# EAGLE design sch-FIX (EAGLE 6.3)
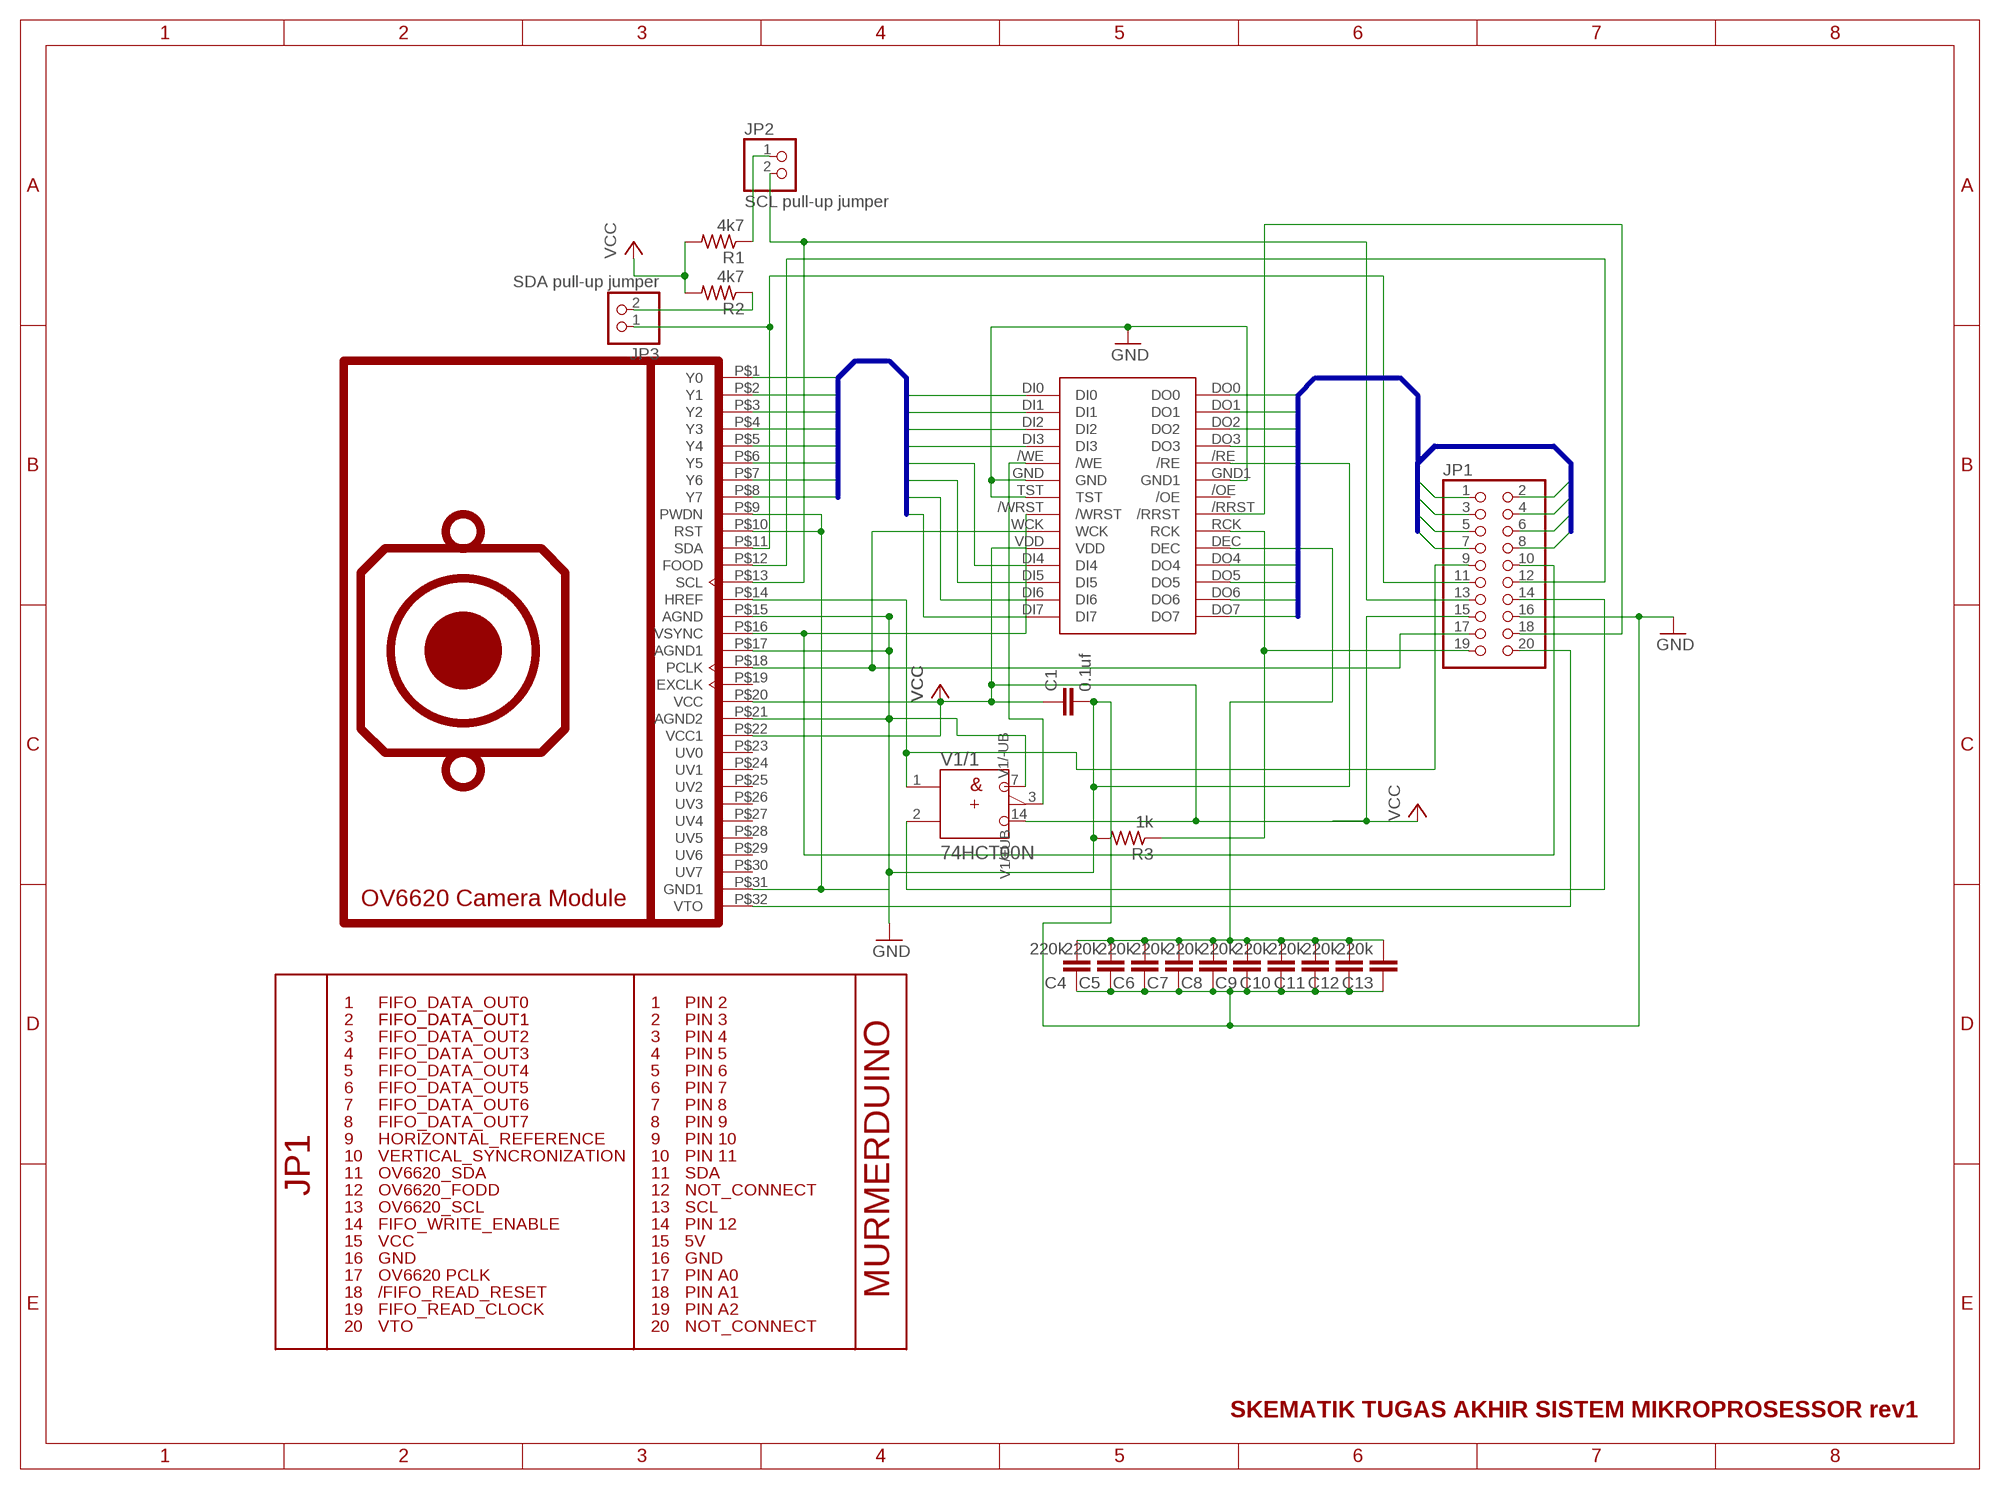
[diagram p0: schematic, sheet 1]

## Parts
C1  0.1uf  C-EU025-025X050  [C025-025X050]
C4  220k  C-EU050-025X075  [C050-025X075]
C5  220k  C-EU050-025X075  [C050-025X075]
C6  220k  C-EU050-025X075  [C050-025X075]
C7  220k  C-EU050-025X075  [C050-025X075]
C8  220k  C-EU050-025X075  [C050-025X075]
C9  220k  C-EU050-025X075  [C050-025X075]
C10  220k  C-EU050-025X075  [C050-025X075]
C11  220k  C-EU050-025X075  [C050-025X075]
C12  220k  C-EU050-025X075  [C050-025X075]
C13  220k  C-EU050-025X075  [C050-025X075]
JP1  PINHD-2X10  [2X10]
JP2  SCL pull-up jumper  PINHD-1X2  [1X02]
JP3  SDA pull-up jumper  PINHD-1X2  [1X02]
R1  4k7  R-US_0204/7  [0204/7]
R2  4k7  R-US_0204/7  [0204/7]
R3  1k  R-US_0204/7  [0204/7]
U$1  AL422REMOVABLE_MOUNT  [AL422REMOVABLE_MOUNT]
U$2  C3088MODULE  [C3088MODULE]
V1  74HCT00N  [DIL14]

## Nets
/FIFO_READ_RESET: JP1.18 U$1./RRST
DATA0: U$1.DI0 U$2.P$1(Y0)
DATA1: U$1.DI1 U$2.P$2(Y1)
DATA2: U$1.DI2 U$2.P$3(Y2)
DATA3: U$1.DI3 U$2.P$4(Y3)
DATA4: U$1.DI4 U$2.P$5(Y4)
DATA5: U$1.DI5 U$2.P$6(Y5)
DATA6: U$1.DI6 U$2.P$7(Y6)
DATA7: U$1.DI7 U$2.P$8(Y7)
FIFO_DATA_OUT0: JP1.1 U$1.DO0
FIFO_DATA_OUT1: JP1.2 U$1.DO1
FIFO_DATA_OUT2: JP1.3 U$1.DO2
FIFO_DATA_OUT3: JP1.4 U$1.DO3
FIFO_DATA_OUT4: JP1.5 U$1.DO4
FIFO_DATA_OUT5: JP1.6 U$1.DO5
FIFO_DATA_OUT6: JP1.7 U$1.DO6
FIFO_DATA_OUT7: JP1.8 U$1.DO7
FIFO_READ_CLOCK: JP1.19 R3.1 U$1.RCK
FIFO_WRITE_ENABLE: JP1.14 V1.2(/1:B)
GND: C1.2 C4.1 C5.1 C6.1 C7.1 C8.1 C9.1 C10.1 C11.1 C12.1 C13.1 JP1.16 R3.2 U$1./RE U$2.P$9(PWDN) U$2.P$10(RST) U$2.P$15(AGND) U$2.P$17(AGND1) U$2.P$21(AGND2) U$2.P$31(GND1) V1.7(/-UB:-UB)
HORIZONTAL_REFERENCE: JP1.9 U$2.P$14(HREF) V1.1(/1:A)
N$1: JP1.20 U$2.P$32(VTO)
N$2: U$1./WE V1.3(/1:Y)
N$3: JP1.17 U$1.WCK U$2.P$18(PCLK)
N$4: JP2.1 R1.1
N$6: JP3.2 R2.1
N$10: C4.2 C5.2 C6.2 C7.2 C8.2 C9.2 C10.2 C11.2 C12.2 C13.2 U$1.DEC
N$13: R1.2 R2.2 ; supply symbol labelled VCC
N$14: U$1.GND U$1.GND1 U$1.TST ; supply symbol labelled GND
OV6620_FODD: JP1.12 U$2.P$12(FOOD)
OV6620_SCL: JP1.13 JP2.2 U$2.P$13(SCL)
OV6620_SDA: JP1.11 JP3.1 U$2.P$11(SDA)
VCC: C1.1 JP1.15 U$1.VDD U$2.P$20(VCC) U$2.P$22(VCC1) V1.14(/+UB:+UB)
VERTICAL_SYNCRONIZATION: JP1.10 U$1./WRST U$2.P$16(VSYNC)
Unconnected: U$1./OE U$2.P$19(EXCLK) U$2.P$23(UV0) U$2.P$24(UV1) U$2.P$25(UV2) U$2.P$26(UV3) U$2.P$27(UV4) U$2.P$28(UV5) U$2.P$29(UV6) U$2.P$30(UV7) V1.4(/2:A) V1.5(/2:B) V1.6(/2:Y) V1.8(/3:Y) V1.9(/3:A) V1.10(/3:B) V1.11(/4:Y) V1.12(/4:A) V1.13(/4:B)

## Buses
FIFO_DATA_OUT[0..7]
DATA[0..7]

## Notes on the sheet
- 1 | 1 | PIN 2
- 2 | 2 | PIN 3
- 3 | 3 | PIN 4
- 4 | 4 | PIN 5
- 5 | 5 | PIN 6
- 6 | 6 | PIN 7
- 7 | 7 | PIN 8
- 8 | 8 | PIN 9
- 9 | 9 | PIN 10
- 10 | 10 | PIN 11
- 11 | 11 | SDA
- JP1 | 12 | 12 | NOT_CONNECT
- 13 | 13 | SCL
- 14 | 14 | PIN 12
- 15 | 15 | 5V
- 16 | 16 | GND
- 17 | OV6620 PCLK | 17 | PIN A0
- 18 | 18 | PIN A1 | MURMERDUINO
- 19 | 19 | PIN A2
- 20 | VTO | 20 | NOT_CONNECT
- SKEMATIK TUGAS AKHIR SISTEM MIKROPROSESSOR rev1

## Library data of the parts
C1 C4-C13 = rcl:C-EU: CAPACITOR, European symbol
JP1 = pinhead:PINHD-2X10: PIN HEADER
JP2 JP3 = pinhead:PINHD-1X2: PIN HEADER
R1-R3 = rcl:R-US_: RESISTOR, American symbol
U$1 = Tugas-Akhir-Sistem-Mikroprossesor:AL422REMOVABLE_MOUNT
U$2 = Tugas-Akhir-Sistem-Mikroprossesor:C3088MODULE
V1 = 74ttl-din:74*00: Quad 2-input NAND gate

## Board
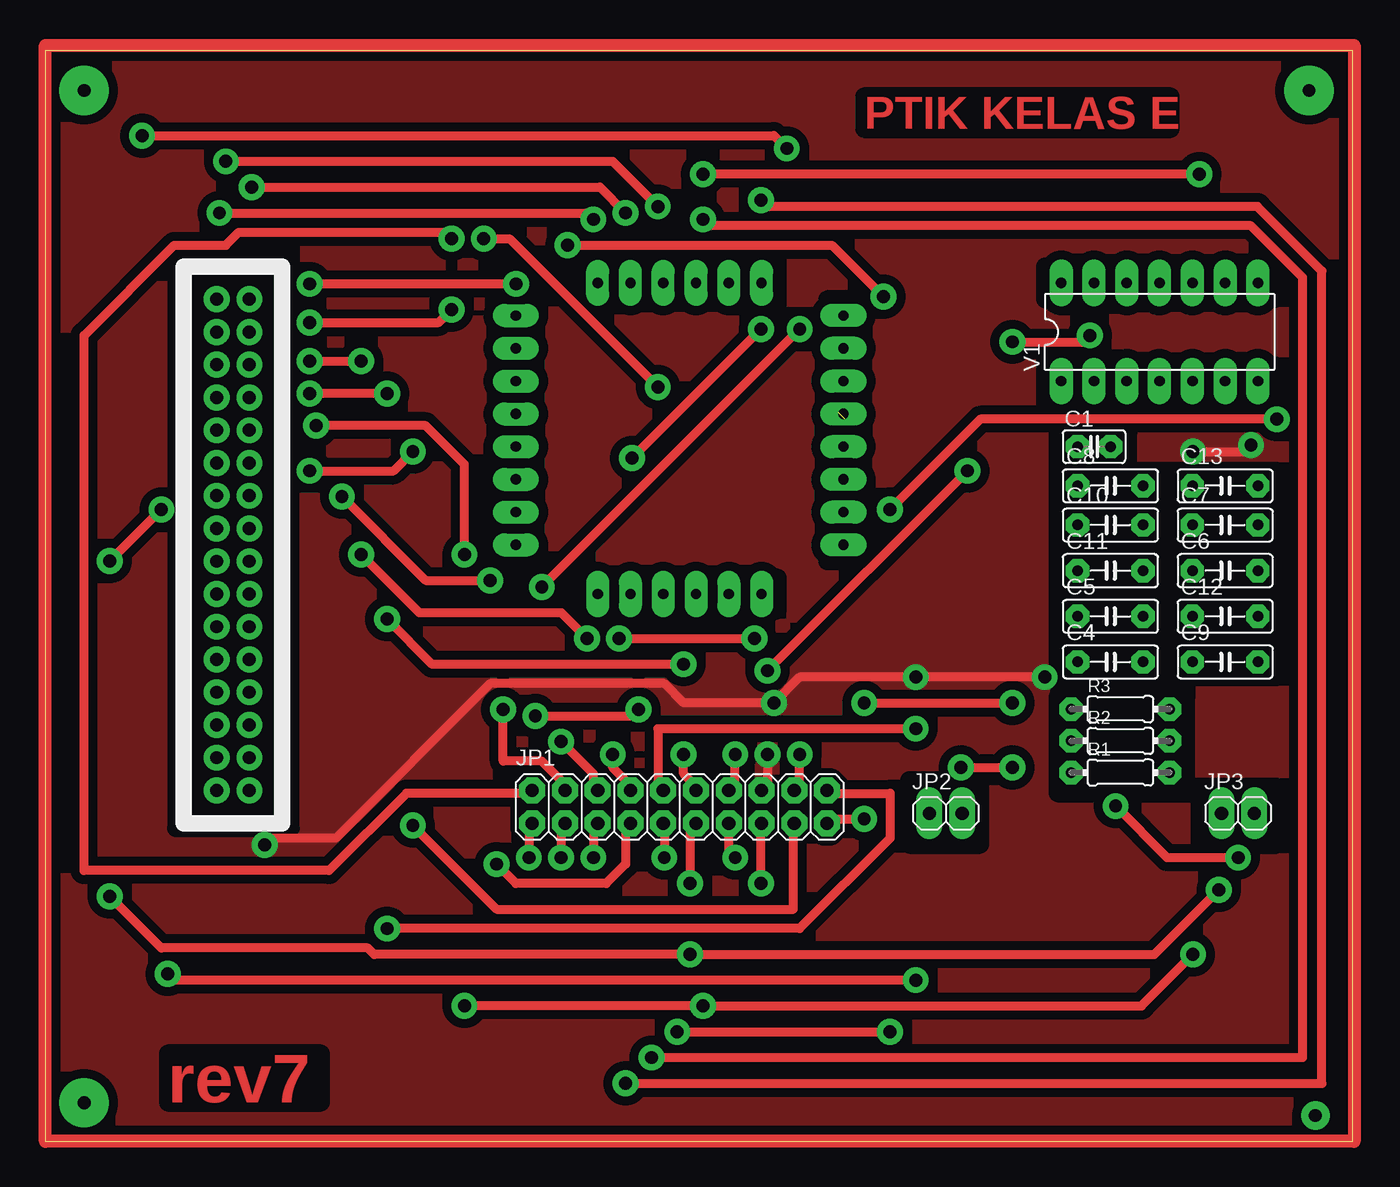
[diagram p1: board, top side]
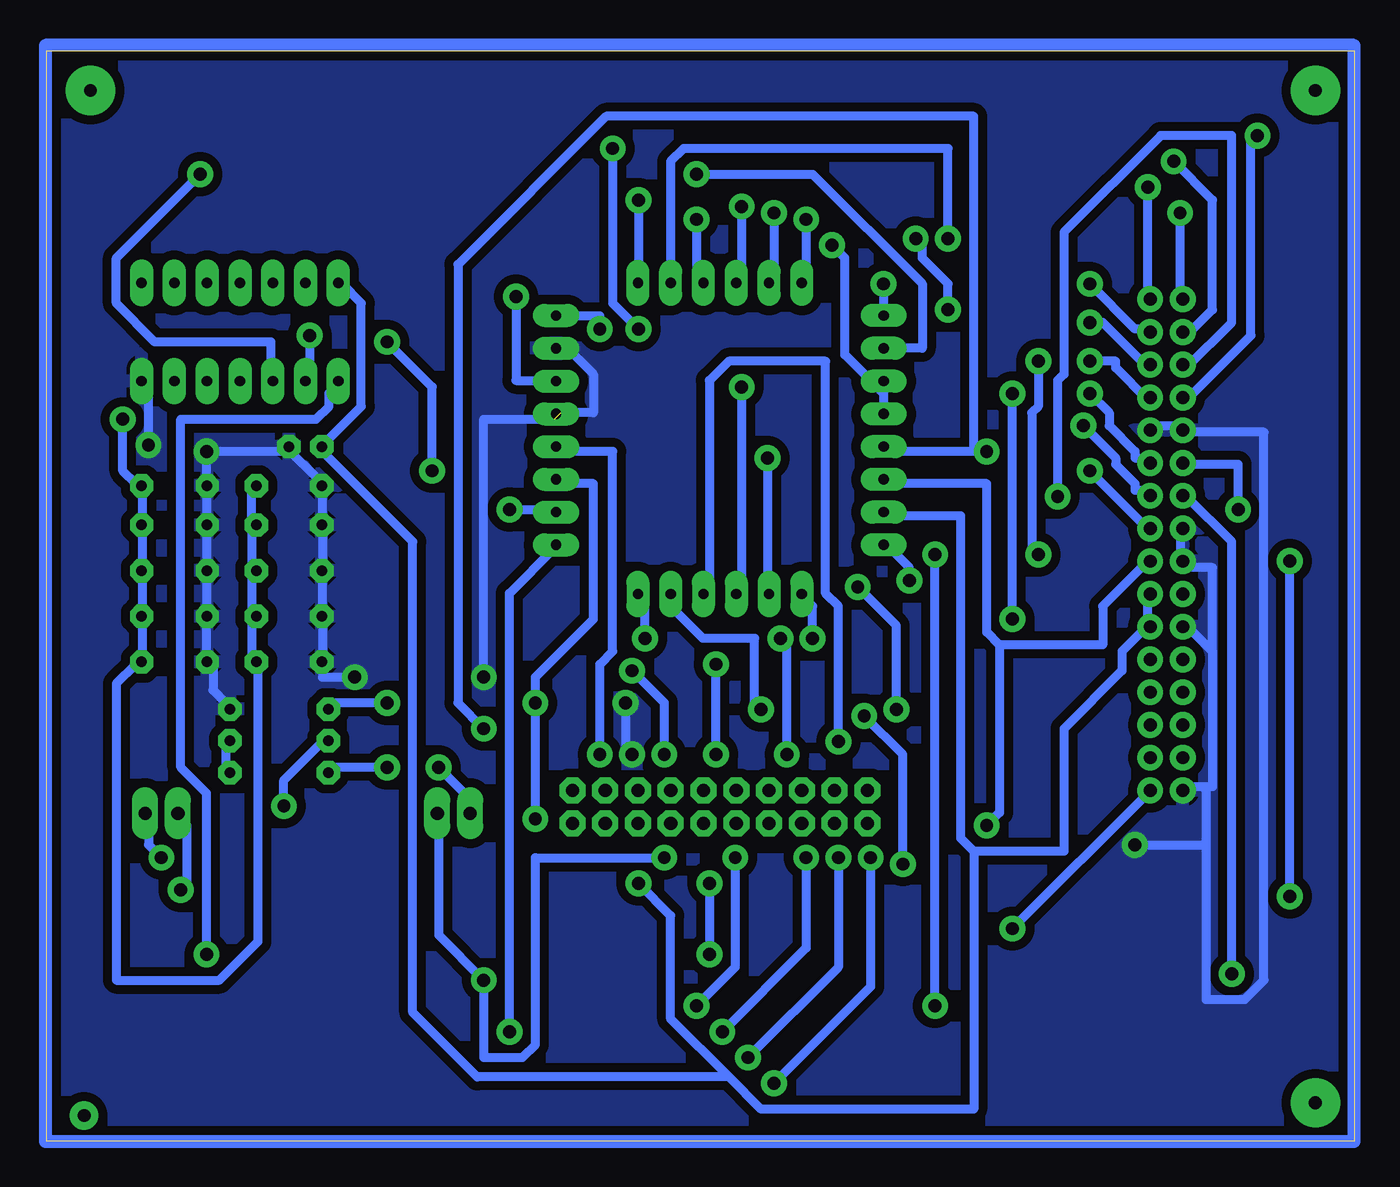
[diagram p2: board, bottom side, seen from below]

Size 101.41 x 84.57 mm. Coordinates in mm from the lower left corner, seen from the top.
Outline: 0,0 101.41,0 101.41,84.57 0,84.57 0,0
Copper layers (1*16): Top 0.035mm / dielectric 1.5mm / Bottom 0.035mm
Design rules "default *": minimum track width 0.7mm, minimum drill 1mm, track to track 0.5mm, track to pad 0.5mm, pad to pad 0.5mm, via to via 0.5mm, smd to smd 8mil, copper to edge 0.5mm, drill to drill 0.5mm, minimum pad ring 0.5mm, minimum via ring 0.5mm, stop-mask expansion 4mil, vias tented up to drill 0mil, thermal gap 10mil
tRestrict: area 35.2,45 to 37.8,65.3; area 41.6,41.2 to 56.8,43.7; area 60.6,45 to 63.2,65.3; area 41.6,65.3 to 56.8,67.8; area 77.5,57.7 to 95.3,60.2; area 77.5,65.3 to 95.3,67.8; area 10.1,24.3 to 19,68.7; area 67,23 to 72.5,28; area 89.5,23 to 95.5,27.5; area 78.5,27 to 88.5,34.5; area 78.5,52.5 to 84,55; area 78.5,36 to 95.5,52
bRestrict: area 36.8,23 to 62.2,28.1

### Footprints (pad centres in the part's own frame; a part is rotated, then mirrored left to right if it is on the bottom)
C025-025X050 = drill 0.813 octagon: 1 -1.27,0; 2 1.27,0
C050-025X075 = drill 0.813 octagon: 1 -2.54,0; 2 2.54,0
2X10 = drill 1.016 octagon: 1 -11.43,-1.27; 2 -11.43,1.27; 3 -8.89,-1.27; 4 -8.89,1.27; 5 -6.35,-1.27; 6 -6.35,1.27; 7 -3.81,-1.27; 8 -3.81,1.27; 9 -1.27,-1.27; 10 -1.27,1.27; 11 1.27,-1.27; 12 1.27,1.27; 13 3.81,-1.27; 14 3.81,1.27; 15 6.35,-1.27; 16 6.35,1.27; 17 8.89,-1.27; 18 8.89,1.27; 19 11.43,-1.27; 20 11.43,1.27
1X02 = drill 1.016 long: 1 -1.27,0; 2 1.27,0
0204/7 = drill 0.813 octagon: 1 -3.81,0; 2 3.81,0
AL422REMOVABLE_MOUNT = drill 0.8 pad 1.676 long: /OE 12.7,1.27; /RE 12.7,6.35; /RRST 12.7,-1.27; /WE -12.7,6.35; /WRST -12.7,-1.27; DEC 12.7,-6.35; DI0 -6.35,11.43; DI1 -3.81,11.43; DI2 -1.27,11.43; DI3 -12.7,8.89; DI4 -12.7,-8.89; DI5 -1.27,-12.7; DI6 -3.81,-12.7; DI7 -6.35,-12.7; DO0 6.35,11.43; DO1 3.81,11.43; DO2 1.27,11.43; DO3 12.7,8.89; DO4 12.7,-8.89; DO5 1.27,-12.7; DO6 3.81,-12.7; DO7 6.35,-12.7; GND -12.7,3.81; GND1 12.7,3.81; RCK 12.7,-3.81; TST -12.7,1.27; VDD -12.7,-6.35; WCK -12.7,-3.81
C3088MODULE = drill 1 pad 1.93: P$1 -1.27,19.05; P$2 1.27,19.05; P$3 -1.27,16.51; P$4 1.27,16.51; P$5 -1.27,13.97; P$6 1.27,13.97; P$7 -1.27,11.43; P$8 1.27,11.43; P$9 -1.27,8.89; P$10 1.27,8.89; P$11 -1.27,6.35; P$12 1.27,6.35; P$13 -1.27,3.81; P$14 1.27,3.81; P$15 -1.27,1.27; P$16 1.27,1.27; P$17 -1.27,-1.27; P$18 1.27,-1.27; P$19 -1.27,-3.81; P$20 1.27,-3.81; P$21 -1.27,-6.35; P$22 1.27,-6.35; P$23 -1.27,-8.89; P$24 1.27,-8.89; P$25 -1.27,-11.43; P$26 1.27,-11.43; P$27 -1.27,-13.97; P$28 1.27,-13.97; P$29 -1.27,-16.51; P$30 1.27,-16.51; P$31 -1.27,-19.05; P$32 1.27,-19.05
DIL14 = drill 0.813 long: 1 -7.62,-3.81; 2 -5.08,-3.81; 3 -2.54,-3.81; 4 0,-3.81; 5 2.54,-3.81; 6 5.08,-3.81; 7 7.62,-3.81; 8 7.62,3.81; 9 5.08,3.81; 10 2.54,3.81; 11 0,3.81; 12 -2.54,3.81; 13 -5.08,3.81; 14 -7.62,3.81

### Placement (x,y rotation side)
C1  81.33,53.88 0 top
C4  82.6,37.18 0 top
C5  82.6,40.72 0 top
C6  91.49,44.26 0 top
C7  91.49,47.8 0 top
C8  82.6,50.84 0 top
C9  91.49,37.18 0 top
C10  82.6,47.8 0 top
C11  82.6,44.26 0 top
C12  91.49,40.72 0 top
C13  91.49,50.84 0 top
JP1  49.19,25.94 0 top
JP2  69.83,25.44 0 top
JP3  92.49,25.44 0 top
R1  83.37,28.6 0 top
R2  83.37,31.06 0 top
R3  83.37,33.52 0 top
U$1  49.19,55.15 0 top
U$2  14.55,46.26 0 top
V1  86.41,62.77 0 top

### Tracks (layer width: path | path; a pad name or v marks a point on that pad's centre or on a via)
/FIFO_READ_RESET  (via drill 1)
  Top 0.7: v58.5,30 58.5,27.5 JP1.18
  Bottom 0.7: v58.5,30 58.5,37 57.5,38 57.5,53.5 61.5,53.5 U$1./RRST
DATA0  (via drill 1)
  Top 0.7: v42.5,71.5 42,72 v13.5,72
  Bottom 0.7: v42.5,71.5 42.5,67 U$1.DI0 | v13.5,72 13.5,65.5 U$2.P$1
DATA1  (via drill 1)
  Top 0.7: v45,72 43,74 v16,74
  Bottom 0.7: v45,72 45,67 U$1.DI1 | v16,74 16,65.5 U$2.P$2
DATA2  (via drill 1)
  Top 0.7: v47.5,72.5 44,76 v14,76
  Bottom 0.7: v47.5,72.5 47.5,67 U$1.DI2 | v14,76 11,73 11,64.5 13,62.5 U$2.P$3
DATA3  (via drill 1)
  Top 0.7: v20.5,66.5 v36.5,66.5
  Bottom 0.7: v36.5,66.5 36.5,64.5 U$1.DI3 | v20.5,66.5 17,63 16,63 U$2.P$4
DATA4  (via drill 1)
  Top 0.7: v34.5,43.5 29.5,43.5 v23,50
  Bottom 0.7: v34.5,43.5 34.5,44.5 36,46 U$1.DI4 | v23,50 23,59 22.5,59.5 22.5,70.5 15,78 9.5,78 9.5,63.5 13,60 U$2.P$5
DATA5  (via drill 1)
  Top 0.7: v47.5,58.5 36,70 v34,70 | v31.5,64.5 30.5,63.5 v20.5,63.5
  Bottom 0.7: v47.5,58.5 47.5,42.5 U$1.DI5 | v34,70 33.5,69.5 33.5,68.5 31.5,66.5 v31.5,64.5 | v20.5,63.5 19.5,63.5 16,60 U$2.P$6
DATA6  (via drill 1)
  Top 0.7: v55.5,63 v45.5,53 | v57.5,77 56.5,78 v7.5,78
  Bottom 0.7: v45.5,53 45.5,42.5 U$1.DI6 | v55.5,63 57.5,65 v57.5,77 | v7.5,78 8,77.5 8,62.5 13,57.5 U$2.P$7
DATA7  (via drill 1)
  Top 0.7: v42,39 40,41 29,41 v24.5,45.5 | v20.5,60.5 v24.5,60.5
  Bottom 0.7: v42,39 42,41.5 42.5,42 U$1.DI7 | v24.5,45.5 25,46 25,56.5 24.5,57 v24.5,60.5 | v20.5,60.5 18.5,60.5 18.5,60 16,57.5 U$2.P$8
FIFO_DATA_OUT0  (via drill 1)
  Top 0.7: v55.5,73 56,72.5 94,72.5 99,67.5 99,4.5 v45,4.5 | v37.5,22 37.5,24.5 JP1.1
  Bottom 0.7: v55.5,73 55.5,67 U$1.DO0 | v45,4.5 37.5,12 v37.5,22
FIFO_DATA_OUT1  (via drill 1)
  Top 0.7: v31.5,70 31,70.5 15,70.5 14,69.5 10,69.5 3,62.5 3,21 22,21 28,27 37.5,27 JP1.2
  Bottom 0.7: U$1.DO1 53,76 52,77 31.5,77 v31.5,70
FIFO_DATA_OUT2  (via drill 1)
  Top 0.7: v51,71.5 51.5,71 93.5,71 97.5,67 97.5,6.5 v47,6.5 | v40,22 40,24.5 JP1.3
  Bottom 0.7: v51,71.5 51,67.5 50.5,67 U$1.DO2 | v47,6.5 40,13.5 v40,22
FIFO_DATA_OUT3  (via drill 1)
  Top 0.7: v38.5,43 v58.5,63 | v35.5,33.5 35.5,29.5 38.5,29.5 40.5,27.5 JP1.4
  Bottom 0.7: v58.5,63 58.5,64 61.5,64 U$1.DO3 | v38.5,43 35.5,40 v35.5,33.5
FIFO_DATA_OUT4  (via drill 1)
  Top 0.7: v49,8.5 v65.5,8.5 | v42.5,22 42.5,24.5 JP1.5
  Bottom 0.7: v65.5,8.5 65.5,42.5 62,46 U$1.DO4 | v49,8.5 42.5,15 v42.5,22
FIFO_DATA_OUT5  (via drill 1)
  Top 0.7: v40,31 42.5,28.5 42.5,27.5 JP1.6
  Bottom 0.7: v40,31 40,41.5 41,42.5 41,60.5 48.5,60.5 50,59 50,42.5 U$1.DO5
FIFO_DATA_OUT6  (via drill 1)
  Top 0.7: v46,33.5 45.5,33 v38,33 | v35,21.5 36.5,20 43.5,20 45,21.5 45,24.5 JP1.7
  Bottom 0.7: v46,33.5 46.5,34 46.5,39 50.5,39 52.5,41 52.5,41.5 53,42 U$1.DO6 | v38,33 35,30 v35,21.5
FIFO_DATA_OUT7  (via drill 1)
  Top 0.7: v44.5,39 v55,39 | v44,30 44,29 45.5,27.5 JP1.8
  Bottom 0.7: v55,39 55,41.5 55.5,42 U$1.DO7 | v44.5,39 44,38.5 v44,30
FIFO_READ_CLOCK  (via drill 1)
  Top 0.7: v63.5,25 61,25 JP1.19 | v63.5,34 v75,34
  Bottom 0.7: v63.5,25 v63.5,34 63.5,36 59,40.5 59,51 61.5,51 U$1.RCK | v75,34 79.5,34 R3.1
FIFO_WRITE_ENABLE  (via drill 1)
  Top 0.7: v81,62.5 80.5,62 v75,62 | v56,36.5 v71.5,52 | v53.5,30 53.5,27.5 53,27.5 JP1.14
  Bottom 0.7: v81,62.5 81,59 V1.2 | v75,62 71.5,58.5 v71.5,52 | v56,36.5 53.5,34 v53.5,30
GND  (via drill 1)  (1 unrouted)
  Top 0.7: v93.5,54 93,53.5 v89,53.5 | v56,30 56,27.5 JP1.16 | v77.5,36 v67.5,36 58.5,36 v56.5,34 49.5,34 48,35.5 34.5,35.5 22.5,23.5 17.5,23.5 v17,23
  Bottom 0.7: U$2.P$10 15.5,55.5 13.5,55.5 U$2.P$9 13,55 7,55 7,12.5 8.5,11 11.5,11 11.5,23 | U$2.P$15 13.5,47.5 13.5,45 U$2.P$17 13,44.5 11,44.5 11,38 | 11.5,27.5 11,27.5 11,38 | 11.5,27.5 13,27.5 U$2.P$31 | 11,38 13,40 U$2.P$21 | 11.5,27.5 11.5,23 | R3.2 87.5,34 88.5,35 88.5,37 C9.1 89,37.5 89,40.5 C12.1 89,41 89,44 C6.1 89,44.5 89,47.5 C7.1 89,48 89,50.5 C13.1 89,51 v89,53.5 83,53.5 C1.2 82.5,53.5 80.5,51.5 80.5,51 C8.1 80,50.5 80,48 C10.1 80,47.5 80,44.5 C11.1 80,44 80,41 C5.1 80,40.5 80,37.5 C4.1 80,37 80,36 v77.5,36 | v93.5,54 93.5,58 94,58.5 V1.7 | 61.5,56.5 59,56.5 59,59.5 61,61.5 U$1./RE | v56,30 56.5,30.5 v56.5,34 | 62,56 67.5,56 v67.5,36 | v17,23 11.5,23
  pour Top (isolate 0.7): 0,84.5 101.5,84.5 101.5,0 0,0
  pour Bottom (isolate 0.7): 0,84.5 101.5,84.5 101.5,0 0,0
HORIZONTAL_REFERENCE  (via drill 1)
  Top 0.7: v89,14.5 85,10.5 v51,10.5 v32.5,10.5 | v48,22 48,24.5 JP1.9 | v21,55.5 29.5,55.5 32.5,52.5 v32.5,45.5
  Bottom 0.7: v89,14.5 89,27 91,29 91,56 80.5,56 79.5,57 79.5,58 79,58.5 V1.1 | v51,10.5 48,13.5 v48,22 | v21,55.5 18.5,53 18.5,52.5 17,51 17,50.5 16,50.5 U$2.P$14 | v32.5,10.5 v32.5,45.5
N$1  (via drill 1)
  Top 0.7: v26.5,16.5 58.5,16.5 65.5,23.5 65.5,27 61,27 JP1.20
  Bottom 0.7: v26.5,16.5 16,27 U$2.P$32
N$2  (via drill 1)
  Top 0.7: v89.5,75 v51,75
  Bottom 0.7: U$1./WE 33.5,61.5 33.5,66.5 42,75 v51,75 | v89.5,75 96,68.5 96,65 93,62 84,62 84,59 V1.3
N$3  (via drill 1)
  Top 0.7: v28.5,24.5 35,18 58,18 58,24.5 JP1.17
  Bottom 0.7: 27.5,38.5 28.5,39.5 28.5,51 36,51 U$1.WCK | 27.5,38.5 19.5,38.5 19.5,41.5 16,45 U$2.P$18 | v28.5,24.5 27.5,25.5 27.5,38.5
N$4  (via drill 1)
  Top 0.7: v71,29 v75,29
  Bottom 0.7: v75,29 79.5,29 R1.1 | v71,29 69,27 69,25.5 JP2.1
N$6  (via drill 1)
  Top 0.7: v83,26 87,22 v92.5,22
  Bottom 0.7: v83,26 83,28 80,31 R2.1 | v92.5,22 93.5,23 93.5,25 JP3.2
N$10  (via drill 1)
  Top 0.7: v65.5,49 72.5,56 v95.5,56
  Bottom 0.7: C8.2 85.5,50.5 85.5,48 C10.2 85.5,47.5 85.5,44.5 C11.2 85.5,44 85.5,41 C5.2 85.5,40.5 85.5,37.5 C4.2 85,37 85,15.5 88,12.5 96,12.5 96,35.5 94.5,37 C9.2 94,37.5 94,40.5 C12.2 94,41 94,44 C6.2 94,44.5 94,47.5 C7.2 94,48 94,50.5 C13.2 94.5,51 95.5,52 v95.5,56 | v65.5,49 62,49 U$1.DEC
N$13
  Bottom 0.7: R1.2 87.5,29 87.5,31 R2.2
N$14  (via drill 1)
  Top 0.7: v65,65.5 61,69.5 v40.5,69.5
  Bottom 0.7: 36.5,58 36.5,58.5 U$1.GND | 36.5,58 36.5,56.5 U$1.TST | v65,65.5 65,59 62,59 U$1.GND1 | v40.5,69.5 39.5,68.5 39.5,61 36.5,58
OV6620_FODD  (via drill 1)
  Top 0.7: v26.5,58 v20.5,58 | v26.5,40.5 30,37 v49.5,37 | v49.5,30 49.5,28.5 50.5,27.5 JP1.12
  Bottom 0.7: v20.5,58 19,56.5 19,55.5 17,53.5 17,53 16,53 U$2.P$12 | v26.5,40.5 v26.5,58 | v49.5,30 v49.5,37
OV6620_SCL  (via drill 1)
  Top 0.7: v9.5,13 10,12.5 v67.5,12.5 | JP1.13 53,22 v53.5,22
  Bottom 0.7: v9.5,13 9.5,46.5 13,50 U$2.P$13 | JP2.2 71,25 71,16 v67.5,12.5 67.5,6.5 64.5,6.5 63.5,7.5 63.5,22 v53.5,22
OV6620_SDA  (via drill 1)
  Top 0.7: v5,45 v9,49 | v5,19 9,15 25,15 25.5,14.5 v50,14.5 86,14.5 v91,19.5 | v50,20 50,24.5 JP1.11
  Bottom 0.7: v9,49 9,52.5 13,52.5 U$2.P$11 | v5,19 v5,45 | v50,20 v50,14.5 | v91,19.5 90.5,20 90.5,24.5 91,25 JP3.1
S$1  (via drill 1 pad 3.81)
  other vias: 3,81.5
S$2  (via drill 1 pad 2.18)
  other vias: 98.5,2
S$3
  Top 1.016: 0,85 101.5,85 101.5,0 0,0 0,85
S$4
  pour Top (isolate 0.7): 0,84.5 101.5,84.5 101.5,0 0,0
S$5
  pour Bottom (isolate 0.7): 0,84.5 101.5,84.5 101.5,0 0,0
S$6  (via drill 1 pad 3.81)
  other vias: 98,81.5
S$7  (via drill 1 pad 3.81)
  other vias: 3,3
S$8
  Bottom 1.016: 0,85 101.5,85 101.5,0 0,0 0,85
VCC  (via drill 1)
  Top 0.7: v55.5,20 55.5,24.5 JP1.15
  Bottom 0.7: V1.14 78.5,66.5 77,65 77,57 80,54 C1.1 80,53.5 73,46.5 73,10 68,5 48.5,5 | 29.5,22.5 30.5,23.5 30.5,48.5 36,48.5 U$1.VDD | 29.5,22.5 22.5,22.5 22.5,32 18,36.5 18,38 16,40 | 16,40 16,42 U$2.P$20 | 16,40 U$2.P$22 | v55.5,20 53,17.5 53,9.5 48.5,5 | 48.5,5 46,2.5 29.5,2.5 29.5,22.5
VERTICAL_SYNCRONIZATION  (via drill 1)
  Top 0.7: v28.5,53.5 27,52 v20.5,52 | v67.5,32 47.5,32 47.5,27.5 JP1.10
  Bottom 0.7: v28.5,53.5 29.5,53.5 | 29.5,53.5 36,53.5 U$1./WRST | v20.5,52 16,47.5 U$2.P$16 | v67.5,32 69.5,34 69.5,68 58,79.5 29.5,79.5 29.5,53.5

### Text on the board
Top: PTIK KELAS E | rev7